# EAGLE design CAN Control (EAGLE 9.5.2)

## Sheet 1 of 2
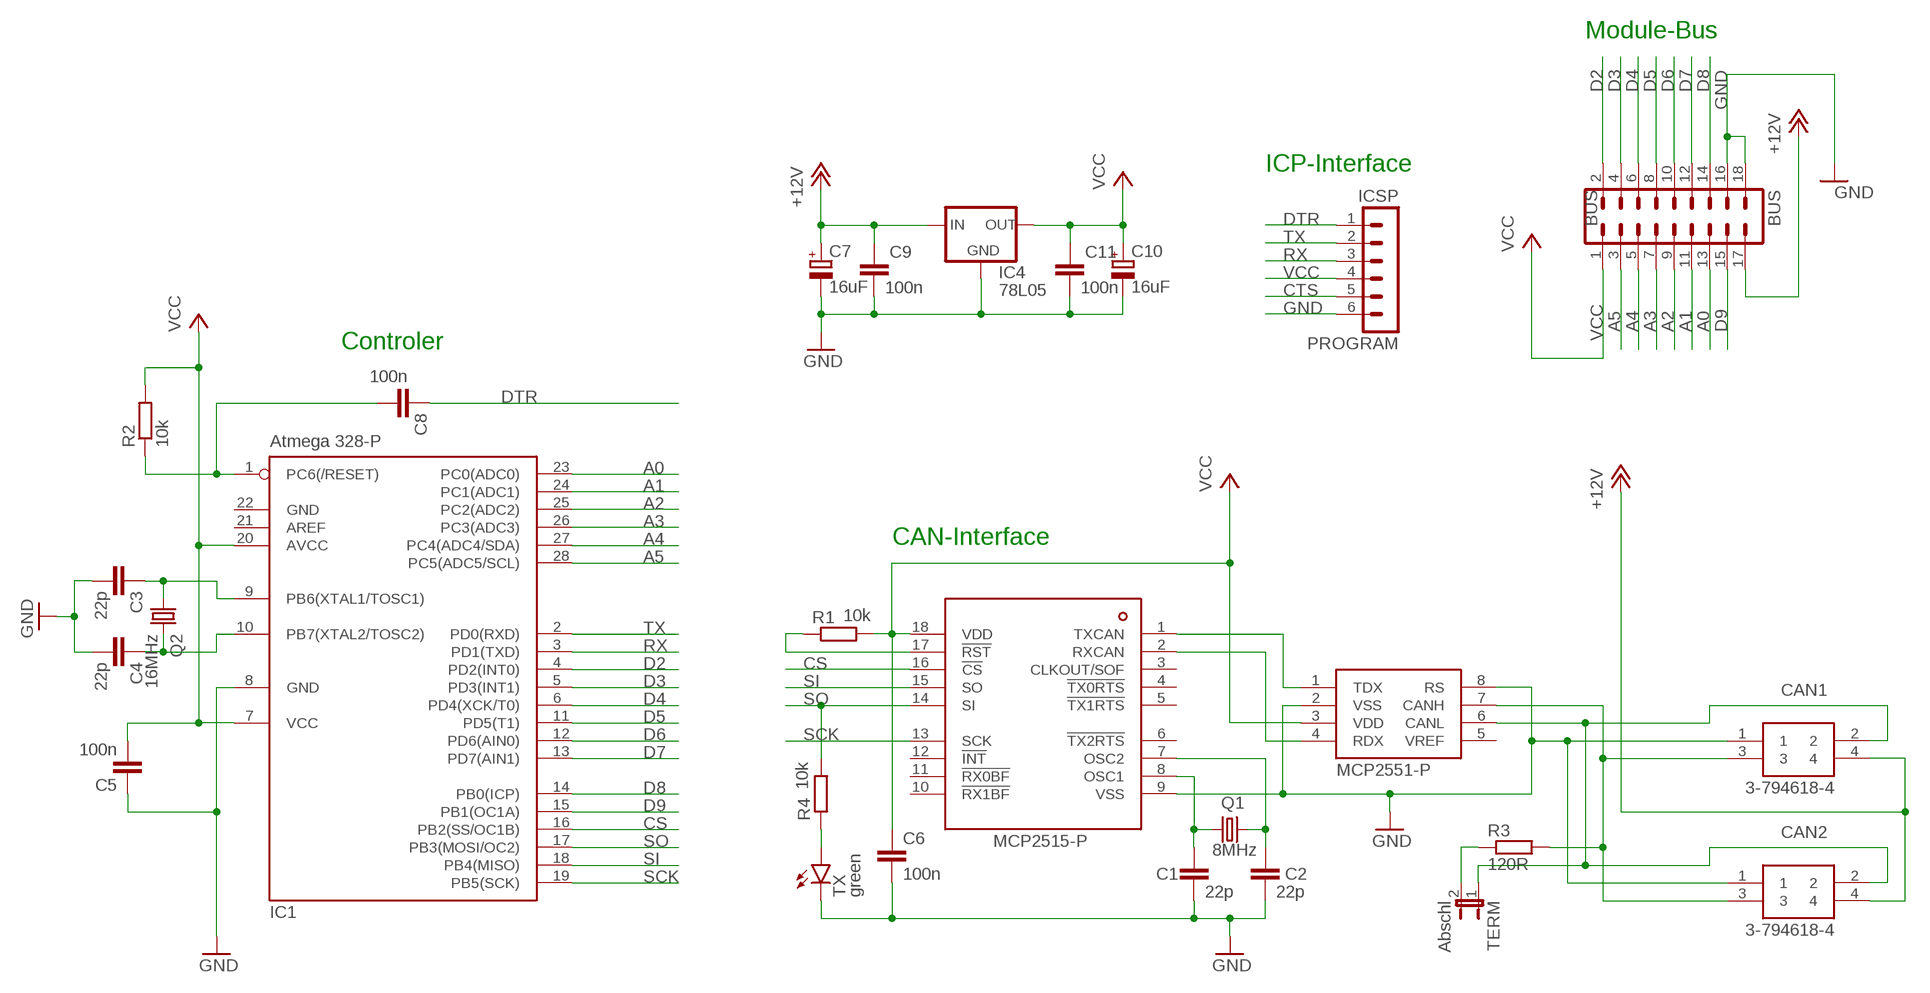
[diagram p0: schematic, sheet 1]

### Parts
BUS  BUS  MA09-2  [MA09-2]
C1  22p  C-EU025-024X044  [C025-024X044]
C2  22p  C-EU025-024X044  [C025-024X044]
C3  22p  C-EU025-024X044  [C025-024X044]
C4  22p  C-EU025-024X044  [C025-024X044]
C5  100n  C-EU025-024X044  [C025-024X044]
C6  100n  C-EU025-024X044  [C025-024X044]
C7  16uF  CPOL-EUE2-5  [E2-5]
C8  100n  C-EU025-024X044  [C025-024X044]
C9  100n  C-EU025-024X044  [C025-024X044]
C10  16uF  CPOL-EUE2-5  [E2-5]
C11  100n  C-EU025-024X044  [C025-024X044]
CAN1  3-794618-4  [SHDRRA4W102P300_2X2_686X892X73]
CAN2  3-794618-4  [SHDRRA4W102P300_2X2_686X892X73]
IC1  Atmega 328-P  MEGA8-P  [DIL28-3]
IC2  MCP2515-P  [DIL18]
IC3  MCP2551-P  [DIL8]
IC4  78L05  78LXX  [78LXX]
PROGRAM  ICSP  MA06-1  [MA06-1]
Q1  8MHz  CRYSTALHC49S  [HC49/S]
Q2  16MHz  CRYSTALHC49S  [HC49/S]
R1  10k  R-EU_0204/2V  [0204V]
R2  10k  R-EU_0204/2V  [0204V]
R3  120R  R-EU_0204/2V  [0204V]
R4  10k  R-EU_0204/2V  [0204V]
TERM  Abschl  JP1E  [JP1]
TX  green  LED3MM  [LED3MM]

### Nets
+12V: BUS.17 C7.+ C9.1 CAN1.4 CAN2.4 IC4.IN
A0: BUS.13 IC1.23(PC0(ADC0))
A1: BUS.11 IC1.24(PC1(ADC1))
A2: BUS.9 IC1.25(PC2(ADC2))
A3: BUS.7 IC1.26(PC3(ADC3))
A4: BUS.5 IC1.27(PC4(ADC4/SDA))
A5: BUS.3 IC1.28(PC5(ADC5/SCL))
CAN2: CAN1.2 CAN2.2 IC3.6(CANL) TERM.1
CAN-H: CAN1.3 CAN2.3 IC3.7(CANH) R3.2
CAN-OCC1: C1.1 IC2.8(OSC1) Q1.1
CAN-OCC2: C2.1 IC2.7(OSC2) Q1.2
CS: IC1.16(PB2(SS/OC1B)) IC2.16(!CS)
CTS: PROGRAM.5
D2: BUS.2 IC1.4(PD2(INT0))
D3: BUS.4 IC1.5(PD3(INT1))
D4: BUS.6 IC1.6(PD4(XCK/T0))
D5: BUS.8 IC1.11(PD5(T1))
D6: BUS.10 IC1.12(PD6(AIN0))
D7: BUS.12 IC1.13(PD7(AIN1))
D8: BUS.14 IC1.14(PB0(ICP))
D9: BUS.15 IC1.15(PB1(OC1A))
DTR: C8.1 PROGRAM.1
GND: BUS.16 BUS.18 C1.2 C2.2 C3.2 C4.2 C5.1 C6.2 C7.- C9.2 C10.- C11.2 CAN1.1 CAN2.1 IC1.8(GND) IC2.9(VSS) IC3.2(VSS) IC3.8(RS) IC4.GND PROGRAM.6 TX.K(C)
N$1: R4.1 TX.A
N$6: IC2.17(!RST) R1.1
N$10: C3.1 IC1.9(PB6(XTAL1/TOSC1)) Q2.1
N$11: C4.1 IC1.10(PB7(XTAL2/TOSC2)) Q2.2
N$14: R3.1 TERM.2
N$15: C8.2 IC1.1(PC6(/RESET)) R2.1
RX: IC1.3(PD1(TXD)) PROGRAM.3
RXCAN: IC2.2(RXCAN) IC3.4(RDX)
SCK: IC1.19(PB5(SCK)) IC2.13(SCK)
SI: IC1.18(PB4(MISO)) IC2.15(SO)
SO: IC1.17(PB3(MOSI/OC2)) IC2.14(SI) R4.2
TX: IC1.2(PD0(RXD)) PROGRAM.2
TXCAN: IC2.1(TXCAN) IC3.1(TDX)
VCC: BUS.1 C5.2 C6.1 C10.+ C11.1 IC1.7(VCC) IC1.20(AVCC) IC2.18(VDD) IC3.3(VDD) IC4.OUT PROGRAM.4 R1.2 R2.2
Unconnected: IC1.21(AREF) IC2.3(CLKOUT/SOF) IC2.4(!TX0RTS) IC2.5(!TX1RTS) IC2.6(!TX2RTS) IC2.10(!RX1BF) IC2.11(!RX0BF) IC2.12(!INT) IC3.5(VREF)

### Notes on the sheet
- Module-Bus
- ICP-Interface
- Controler
- CAN-Interface

## Sheet 2 of 2

## Power pins joined to a net without a drawn wire
GND: IC1.22(GND)

## Library data of the parts
BUS = con-lstb:MA09-2: PIN HEADER; OC_FARNELL: unknown; OC_NEWARK: unknown
C1-C6 C8 C9 C11 = rcl:C-EU: CAPACITOR, European symbol; SPICEPREFIX: C
C7 C10 = rcl:CPOL-EU: POLARIZED CAPACITOR, European symbol; SPICEPREFIX: C
CAN1 CAN2 = SamacSys_Parts:3-794618-4: 4 way 2 row r/a header Mate-N-Lok Source: Datasheet <https://rs.componentsearchengine.com/Datasheets/2/3-794618-4.pdf>; DESCRIPTION: 4 way 2 row r/a header Mate-N-Lok; HEIGHT: 7.37mm; MANUFACTURER_NAME: TE Connectivity; MANUFACTURER_PART_NUMBER: 3-794618-4
IC1 = atmel:MEGA8-P: MICROCONTROLLER 8 Kbytes FLASH, 1 kbytes SRAM, 512 bytes EEPROM, USART, 4-channel 10 bit ADC, 2-channel 8 bit ADC Pin compatible with Atmega48, ATMega88, ATMega168 Source: avr.lbr; OC_FARNELL: unknown; OC_NEWARK: unknown
IC2 = mcp2514:MCP2515-P: Microchip Technology’s MCP2515 is a stand-alone Controller Area Network (CAN) controller that implements the CAN specification, version 2.0B. It is capable of transmitting and receiving both standard and extended data and remote frames. The MCP2515 has two acceptance masks and six acceptance filters that are used to filter out unwanted messages, thereby reducing the host MCUs overhead. The MCP2515 interfaces with microcontrollers (MCUs) via an industry standard Serial Peripheral Interface (SPI).
IC3 = mcp2514:MCP2551-P
IC4 = v-reg:78LXX: VOLTAGE REGULATOR
PROGRAM = con-lstb:MA06-1: PIN HEADER; OC_FARNELL: unknown; OC_NEWARK: unknown
Q1 Q2 = crystal:CRYSTAL: CRYSTAL; OC_FARNELL: 1667008; OC_NEWARK: unknown
R1-R4 = rcl:R-EU_: RESISTOR, European symbol; SPICEPREFIX: R
TERM = jumper:JP1E: JUMPER
TX = led:LED: LED OSRAM: - CHIPLED LG R971, LG N971, LY N971, LG Q971, LY Q971, LO R971, LY R971 LH N974, LH R974 LS Q976, LO Q976, LY Q976 LO Q996 - Hyper CHIPLED LW Q18S LB Q993, LB Q99A, LB R99A - SideLED LS A670, LO A670, LY A670, LG A670, LP A670 LB A673, LV A673, LT A673, LW A673 LH A674 LY A675 LS A676, LA A676, LO A676, LY A676, LW A676 LS A679, LY A679, LG A679 - Hyper Micro SIDELED® LS Y876, LA Y876, LO Y876, LY Y876 LT Y87S - SmartLED LW L88C, LW L88S LB L89C, LB L89S, LG L890 LS L89K, LO L89K, LY L89K LS L896, LA L896, LO L896, LY L896 - TOPLED LS T670, LO T670, LY T670, LG T670, LP T670 LSG T670, LSP T670, LSY T670, LOP T670, LYG T670 LG T671, LOG T671, LSG T671 LB T673, LV T673, LT T673, LW T673 LH T674 LS T676, LA T676, LO T676, LY T676, LB T676, LH T676, LSB T676, LW T676 LB T67C, LV T67C, LT T67C, LS T67K, LO T67K, LY T67K, LW E67C LS E67B, LA E67B, LO E67B, LY E67B, LB E67C, LV E67C, LT E67C LW T67C LS T679, LY T679, LG T679 LS T770, LO T770, LY T770, LG T770, LP T770 LB T773, LV T773, LT T773, LW T773 LH T774 LS E675, LA E675, LY E675, LS T675 LS T776, LA T776, LO T776, LY T776, LB T776 LHGB T686 LT T68C, LB T68C - Hyper Mini TOPLED® LB M676 - Mini TOPLED Santana® LG M470 LS M47K, LO M47K, LY M47K Source: http://www.osram.convergy.de LUXEON: - LUMILED® LXK2-PW12-R00, LXK2-PW12-S00, LXK2-PW14-U00, LXK2-PW14-V00 LXK2-PM12-R00, LXK2-PM12-S00, LXK2-PM14-U00 LXK2-PE12-Q00, LXK2-PE12-R00, LXK2-PE12-S00, LXK2-PE14-T00, LXK2-PE14-U00 LXK2-PB12-K00, LXK2-PB12-L00, LXK2-PB12-M00, LXK2-PB14-N00, LXK2-PB14-P00, LXK2-PB14-Q00 LXK2-PR12-L00, LXK2-PR12-M00, LXK2-PR14-Q00, LXK2-PR14-R00 LXK2-PD12-Q00, LXK2-PD12-R00, LXK2-PD12-S00 LXK2-PH12-R00, LXK2-PH12-S00 LXK2-PL12-P00, LXK2-PL12-Q00, LXK2-PL12-R00 Source: www.luxeon.com KINGBRIGHT: KA-3528ASYC Source: www.kingbright.com

## Board
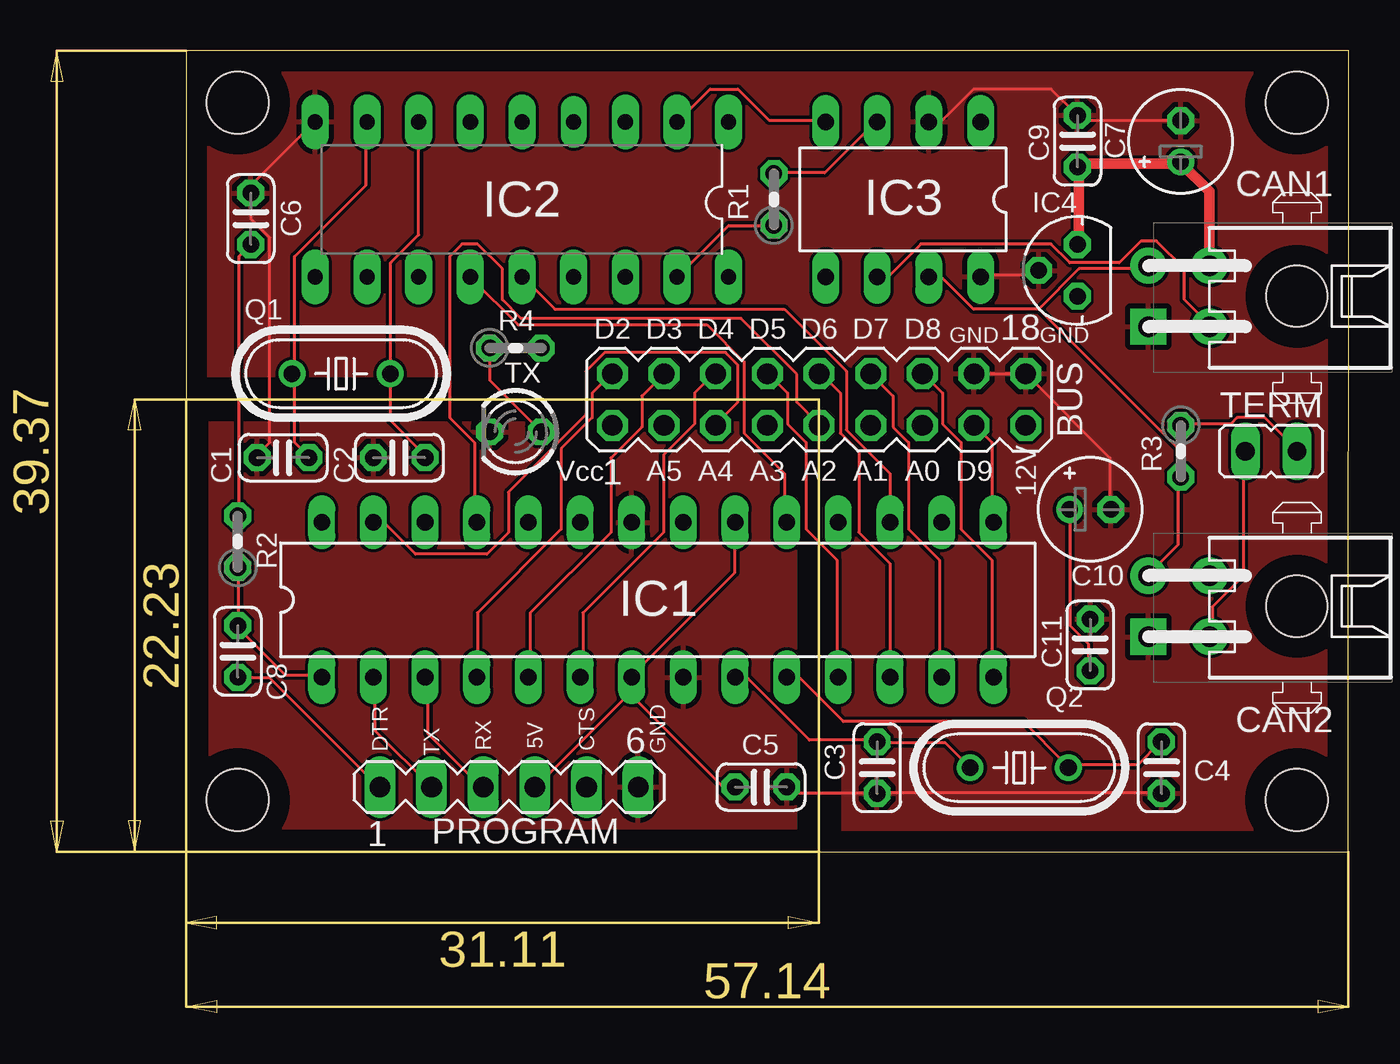
[diagram p1: board, top side]
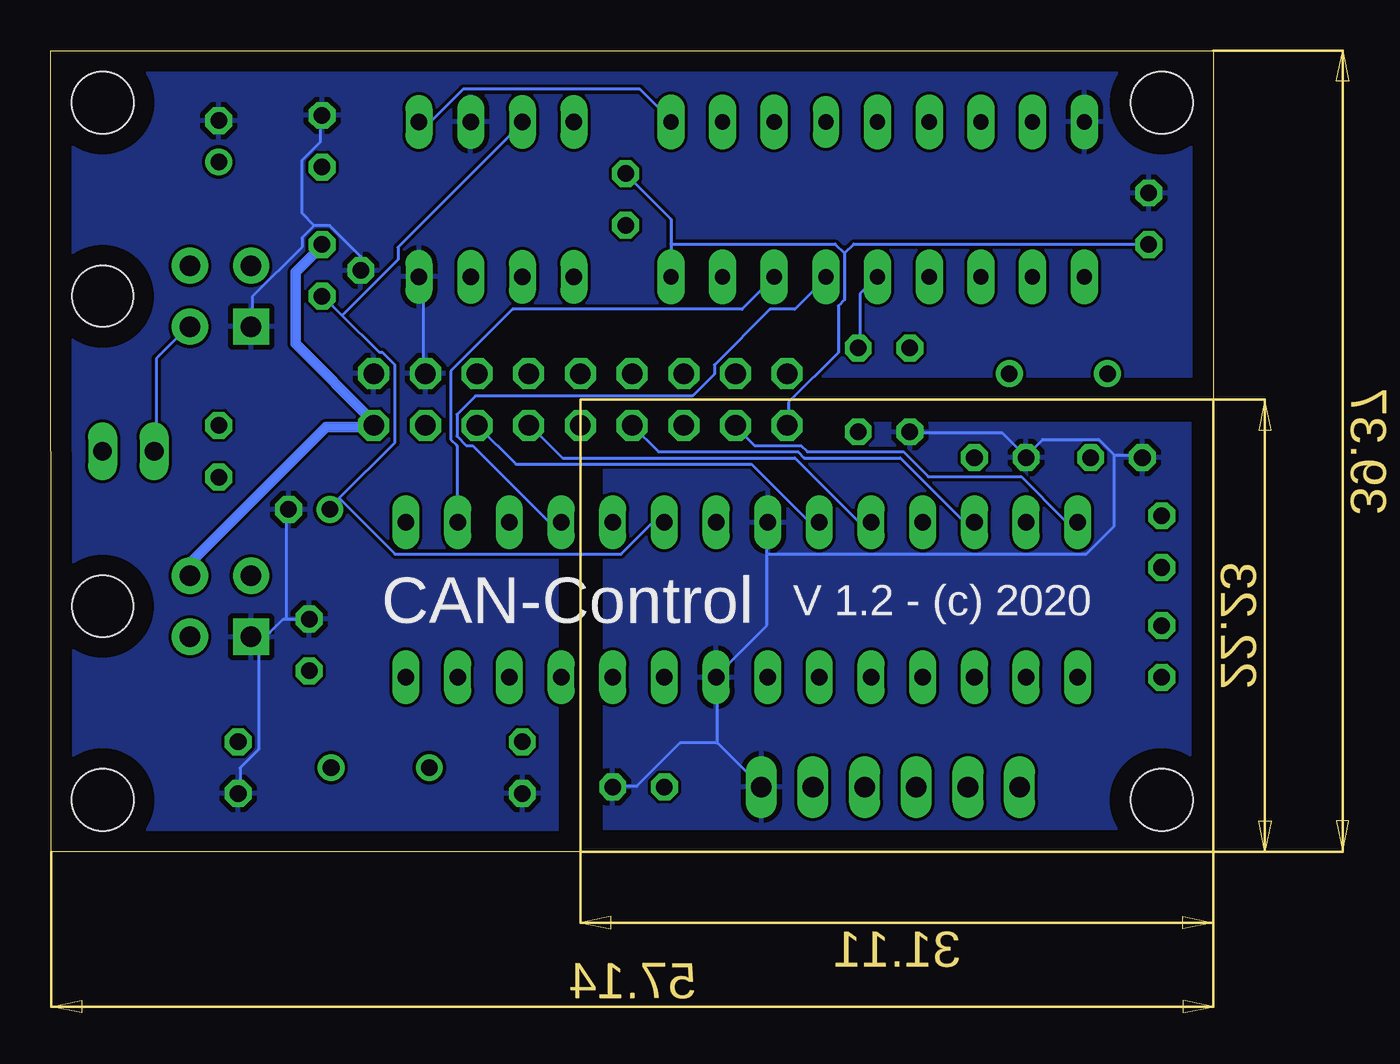
[diagram p2: board, bottom side, seen from below]

Size 57.15 x 39.37 mm. Coordinates in mm from the lower left corner, seen from the top.
Outline: 0,0 57.14,0 57.15,39.37 0,39.37 0,0
Copper layers (1*16): Top 0.035mm / dielectric 1.5mm / Bottom 0.035mm
Design rules "default": minimum track width 6mil, minimum drill 0.35mm, track to track 6mil, track to pad 6mil, pad to pad 6mil, via to via 6mil, smd to smd 6mil, copper to edge 40mil, drill to drill 6mil, minimum pad ring 10mil, minimum via ring 8mil, stop-mask expansion 4mil, vias tented up to drill 0mil, thermal gap 10mil
Holes 3.05 mm at 2.54,36.83 2.54,2.54 54.61,2.54 54.61,36.83

### Footprints (pad centres in the part's own frame; a part is rotated, then mirrored left to right if it is on the bottom)
MA09-2 = drill 1.016 octagon: 1 -10.16,-1.27; 2 -10.16,1.27; 3 -7.62,-1.27; 4 -7.62,1.27; 5 -5.08,-1.27; 6 -5.08,1.27; 7 -2.54,-1.27; 8 -2.54,1.27; 9 0,-1.27; 10 0,1.27; 11 2.54,-1.27; 12 2.54,1.27; 13 5.08,-1.27; 14 5.08,1.27; 15 7.62,-1.27; 16 7.62,1.27; 17 10.16,-1.27; 18 10.16,1.27
C025-024X044 = drill 0.813 octagon: 1 -1.27,0; 2 1.27,0
E2-5 = drill 0.813 pad 1.27: + -1.016,0 | drill 0.813 pad 1.27 octagon: - 1.016,0
SHDRRA4W102P300_2X2_686X892X73 = drill 1 pad 1.778 square: 1 1.5,-7.3 | drill 1 pad 1.778: 2 1.5,-4.3; 3 -1.5,-7.3; 4 -1.5,-4.3 | hole 3: 0,0
DIL28-3 = drill 0.813 long: 1 -16.51,-3.81; 2 -13.97,-3.81; 3 -11.43,-3.81; 4 -8.89,-3.81; 5 -6.35,-3.81; 6 -3.81,-3.81; 7 -1.27,-3.81; 8 1.27,-3.81; 9 3.81,-3.81; 10 6.35,-3.81; 11 8.89,-3.81; 12 11.43,-3.81; 13 13.97,-3.81; 14 16.51,-3.81; 15 16.51,3.81; 16 13.97,3.81; 17 11.43,3.81; 18 8.89,3.81; 19 6.35,3.81; 20 3.81,3.81; 21 1.27,3.81; 22 -1.27,3.81; 23 -3.81,3.81; 24 -6.35,3.81; 25 -8.89,3.81; 26 -11.43,3.81; 27 -13.97,3.81; 28 -16.51,3.81
DIL18 = drill 0.743 pad 1.343 long: 1 -3.81,10.16; 2 -3.81,7.62; 3 -3.81,5.08; 5 -3.81,0; 6 -3.81,-2.54; 7 -3.81,-5.08; 8 -3.81,-7.62; 9 -3.81,-10.16; 10 3.81,-10.16; 11 3.81,-7.62; 12 3.81,-5.08; 13 3.81,-2.54; 14 3.81,0; 15 3.81,2.54; 16 3.81,5.08; 17 3.81,7.62; 18 3.81,10.16 | drill 0.743 pad 1.27 long: 4 -3.81,2.54
DIL8 = drill 0.813 long: 1 -3.81,-3.81; 2 -1.27,-3.81; 3 1.27,-3.81; 4 3.81,-3.81; 5 3.81,3.81; 6 1.27,3.81; 7 -1.27,3.81; 8 -3.81,3.81
78LXX = drill 0.813 octagon: GND 0,1.905; IN 1.27,0; OUT -1.27,0
MA06-1 = drill 1.016 long: 1 -6.35,0; 2 -3.81,0; 3 -1.27,0; 4 1.27,0; 5 3.81,0; 6 6.35,0
HC49/S = drill 0.813: 1 -2.413,0; 2 2.413,0
0204V = drill 0.813 octagon: 1 -1.27,0; 2 1.27,0
JP1 = drill 0.914 long: 1 0,-1.27; 2 0,1.27
LED3MM = drill 0.813 octagon: A -1.27,0; K 1.27,0

### Placement (x,y rotation side)
BUS  31.11,22.23 0 top
C1  4.76,19.37 180 top
C2  10.48,19.37 180 top
C3  33.97,4.13 270 top
C4  47.94,4.13 270 top
C5  28.26,3.17 180 top
C6  3.17,31.11 90 top
C7  48.9,34.92 90 top
C8  2.54,9.84 90 top
C9  43.81,34.92 90 top
C10  44.45,16.83 0 top
C11  44.45,10.16 90 top
CAN1  54.61,27.3 270 top
CAN2  54.61,12.06 270 top
IC1  23.18,12.38 0 top
IC2  16.51,32.07 270 top
IC3  35.24,32.07 180 top
IC4  43.81,28.57 90 top
PROGRAM  15.88,3.17 0 top
Q1  7.62,23.5 0 top
Q2  40.96,4.13 0 top
R1  28.89,32.07 90 top
R2  2.54,15.24 90 top
R3  48.9,19.68 270 top
R4  16.19,24.77 0 top
TERM  53.34,19.68 270 top
TX  16.19,20.64 180 top

### Tracks (layer width: path | path; a pad name or v marks a point on that pad's centre or on a via)
+12V
  Top 0.152: 43.89,33.68 C9.1 | 48.92,33.83 C7.+
  Top 0.508: IC4.IN 43.89,29.87 43.89,33.53 C9.1 | 43.89,33.68 44.04,33.83 48.77,33.83 C7.+ | 48.92,33.83 50.29,32.46 50.29,28.96 CAN1.4
  Bottom 0.152: 41.3,21.03 BUS.17 41.3,20.88 | 43.89,29.72 IC4.IN
  Bottom 0.508: 41.3,21.03 41.3,21.14 45.12,24.97 45.12,28.49 43.89,29.72 | CAN2.4 50.31,14.19 43.62,20.88 41.3,20.88
A0
  Bottom 0.152: BUS.13 34.29,19.05 22.71,19.05 19.96,16.31 19.51,16.31 IC1.23
A1
  Bottom 0.152: IC1.24 16.92,16.31 17.53,16.31 20.57,19.36 32,19.36 33.53,20.88 BUS.11
A2
  Top 0.152: IC1.25 14.17,16.31 14.17,20.12 12.95,21.34 12.95,29.26 13.56,29.87 14.33,29.87 15.54,28.65 15.54,27.13 16.46,26.21 27.28,26.21 30.02,23.47 30.02,22.1 31.09,21.03 BUS.9
A3
  Bottom 0.152: BUS.7 27.28,19.66 20.42,19.66 20.12,19.36 15.39,19.36 12.34,16.31 11.89,16.31 IC1.26
A4
  Top 0.152: IC1.27 9.3,16.15 9.75,16.15 11.28,14.63 14.78,14.63 15.85,15.7 15.85,17.68 19.66,21.49 19.66,23.62 20.57,24.54 26.52,24.54 27.13,23.93 27.13,22.1 26.06,21.03 BUS.5
A5
  Bottom 0.152: IC1.28 6.71,16.31 7.32,16.31 9.45,18.44 14.02,18.44 15.24,19.66 19.96,19.66 20.27,19.96 22.55,19.96 23.47,20.88 BUS.3
CAN2
  Top 0.152: IC3.6 33.98,28.35 34.59,28.35 36.12,29.87 42.52,29.87 43.43,28.96 45.87,28.96 46.94,30.02 47.7,30.02 49.07,28.65 49.07,27.13 50.29,25.91 CAN1.2 | CAN2.2 50.44,10.67 50.44,12.04 51.97,13.56 51.97,19.66 TERM.1
  Bottom 0.152: TERM.1 51.97,19.81 51.97,24.23 50.44,25.76 CAN1.2
CAN-H
  Top 0.152: CAN2.3 47.4,13.72 48.77,15.09 48.77,18.29 R3.2 48.77,18.44 48.77,19.81 41.91,26.67 | 41.91,26.67 38.71,26.67 37.19,28.19 36.58,28.19 IC3.7 | 41.91,26.67 43.89,28.65 47.09,28.65 47.24,28.8 CAN1.3
CAN-OCC1
  Top 0.152: C1.1 5.94,19.51 5.33,20.12 5.33,23.47 Q1.1 5.33,23.62 5.33,29.26 8.84,32.77 8.84,35.81 IC2.8
CAN-OCC2
  Top 0.152: C2.1 11.73,19.51 10.06,21.18 10.06,23.47 Q1.2 10.06,23.62 10.06,28.96 11.43,30.33 IC2.7
CS
  Bottom 0.152: IC1.16 37.19,16.31 37.19,19.96 37.49,20.27 37.49,23.62 34.44,26.67 23.16,26.67 21.64,28.19 IC2.16
D2
  Top 0.152: IC1.4 14.33,8.69 14.33,11.73 18.44,15.85 18.44,19.81 19.96,21.34 19.96,22.55 20.88,23.47 BUS.2
D3
  Top 0.152: BUS.4 22.4,22.4 22.4,20.88 20.88,19.36 20.88,15.7 16.92,11.73 16.92,8.69 IC1.5
D4
  Top 0.152: IC1.6 19.51,8.69 19.51,11.73 23.47,15.7 23.47,19.51 24.99,21.03 24.99,22.55 25.91,23.47 BUS.6
D5
  Top 0.152: IC1.11 32,8.69 32,14.33 30.48,15.85 30.48,20.12 29.57,21.03 29.57,22.55 28.65,23.47 BUS.8
D6
  Top 0.152: IC1.12 34.59,8.69 34.59,14.17 33.07,15.7 33.07,19.66 32.16,20.57 32.16,22.55 31.24,23.47 BUS.10
D7
  Top 0.152: BUS.12 34.75,22.4 34.75,20.88 35.51,20.12 35.51,15.85 37.03,14.33 37.03,8.69 IC1.13
D8
  Top 0.152: IC1.14 39.62,8.69 39.62,14.33 38.1,15.85 38.1,20.12 37.19,21.03 37.19,22.55 36.27,23.47 BUS.14
D9
  Top 0.152: IC1.15 39.62,16.31 39.62,20.12 38.86,20.88 BUS.15
DTR
  Top 0.152: C8.1 2.59,8.53 4.12,8.53 9.45,3.2 PROGRAM.1
GND
  Top 0.152: IC2.9 6.25,35.81 3.2,32.77 3.2,32.46 C6.2 3.2,32.31 3.2,31.09 4.12,30.18 4.12,20.12 3.5,19.51 C1.2 | C5.1 29.57,3.05 29.72,2.9 33.83,2.9 C3.2 33.98,2.9 47.85,2.9 C4.2 | IC3.2 36.58,35.97 37.19,35.97 38.71,37.49 42.52,37.49 C9.2 44.04,35.97 48.77,35.97 C7.- | BUS.16 38.86,23.47 41.15,23.47 BUS.18 45.41,19.36 45.41,16.92 C10.- | IC3.8 39.17,28.35 41.76,28.35 41.91,28.5 IC4.GND
  Bottom 0.152: 4.88,19.51 3.5,19.51 C1.2 | 4.88,19.51 5.64,20.27 8.38,20.27 9.14,19.51 C2.2 9.3,19.51 10.36,20.57 14.78,20.57 TX.K | 24.38,5.33 24.38,8.53 IC1.8 24.38,8.69 21.95,11.12 21.95,14.63 | PROGRAM.6 24.38,5.33 | 21.95,14.63 21.95,16.15 IC1.22 | 24.38,5.33 26.21,5.33 28.35,3.2 29.41,3.2 C5.1 | 46.94,10.21 46.94,5.03 47.85,4.12 47.85,2.9 C4.2 | 46.94,10.21 47.24,10.52 CAN2.1 46.94,10.21 | 45.57,11.43 45.72,11.43 46.94,10.21 | 45.57,11.43 C11.2 | 45.57,11.43 45.57,16.76 C10.- | 44.2,30.79 44.81,30.18 44.81,29.72 47.24,27.28 47.24,25.91 CAN1.1 | 44.2,30.79 43.43,30.79 41.91,29.26 IC4.GND | BUS.16 38.86,23.62 38.86,28.04 39.01,28.19 IC3.8 | 44.2,30.79 44.81,31.39 44.81,33.98 43.89,34.9 43.89,36.12 C9.2 | 4.88,19.51 4.88,16 6.25,14.63 21.95,14.63
  pour Bottom: 0,39.37 57.15,39.37 57.15,0 0,0
  pour Top: 0,39.37 57.15,39.37 57.15,0 0,0
N$1
  Top 0.152: TX.A 14.94,23.16 14.94,24.69 R4.1
N$6
  Top 0.152: R1.1 28.8,30.79 26.67,30.79 24.23,28.35 IC2.17
N$10
  Top 0.152: Q2.1 37.34,5.33 33.98,5.33 C3.1 33.83,5.49 30.63,5.49 27.58,8.53 27.13,8.53 IC1.9
N$11
  Top 0.152: C4.1 47.85,5.33 46.79,4.27 43.43,4.27 Q2.2 43.28,4.27 41.15,6.4 32.31,6.4 30.18,8.53 29.57,8.53 IC1.10
N$14
  Top 0.152: R3.1 48.92,21.03 51.36,21.03 51.66,21.34 53.03,21.34 54.56,19.81 TERM.2
N$15
  Top 0.152: IC1.1 6.55,8.69 4.88,8.69 2.59,10.97 C8.2 2.59,11.12 2.59,13.87 R2.1
RX
  Top 0.152: IC1.3 11.89,8.53 11.89,5.79 14.48,3.2 PROGRAM.3
RXCAN
  Top 0.152: IC3.4 31.39,35.97 28.65,35.97 27.13,37.49 25.76,37.49 24.23,35.97 IC2.2
SCK
  Top 0.152: IC1.19 29.41,16.31 29.41,18.59 27.43,20.57 27.43,24.08 25.6,25.91 16.31,25.91 14.02,28.19 IC2.13
SI
  Bottom 0.152: IC1.18 32.16,16.31 32.77,16.31 36.42,19.96 36.73,19.96 37.19,20.42 37.19,21.49 36.27,22.4 25.6,22.4 24.54,23.47 24.54,23.93 21.79,26.67 20.57,26.67 19.05,28.19 IC2.15
SO
  Top 0.152: IC1.17 34.59,16.31 34.59,18.59 32.46,20.73 32.46,23.62 29.41,26.67 18.14,26.67 16.61,28.19 IC2.14
  Bottom 0.152: R4.2 17.37,24.84 17.37,27.43 16.61,28.19 IC2.14
TX
  Top 0.152: PROGRAM.2 9.3,5.94 9.3,8.53 IC1.2
TXCAN
  Bottom 0.152: IC3.1 39.01,35.97 38.41,35.97 36.88,37.49 28.19,37.49 26.67,35.97 IC2.1
VCC
  Top 0.152: 21.79,7.77 21.79,8.53 IC1.7 | 21.79,7.77 17.22,3.2 PROGRAM.4 | 21.79,7.77 26.36,3.2 26.98,3.2 C5.2 | 21.79,7.77 IC1.7 | IC1.20 26.98,16.15 26.98,13.72 21.95,8.69 IC1.7 | C10.+ 43.43,11.12 44.35,10.21 44.35,8.99 C11.1 | C6.1 2.59,29.26 2.59,16.61 R2.2 | R1.2 28.96,33.38 31.39,33.38 33.83,35.81 IC3.3
  Bottom 0.152: 42.82,26.36 41,24.54 40.84,24.54 40.23,23.93 40.23,20.12 42.98,17.37 | 42.82,26.36 43.74,27.28 IC4.OUT | 42.98,17.37 43.43,16.92 C10.+ | 26.67,29.87 26.67,31.09 28.8,33.22 R1.2 | 26.67,29.87 IC2.18 | 18.14,29.41 18.14,27.13 18.44,26.82 18.44,24.54 20.88,22.1 20.88,21.03 BUS.1 | 18.14,29.41 18.59,29.87 26.67,29.87 | 18.14,29.41 17.68,29.87 3.2,29.87 C6.1 | 42.82,26.36 40.08,29.11 40.08,29.72 33.98,35.81 IC3.3 | 42.98,17.37 40.23,14.63 29.11,14.63 27.58,16.15 27.13,16.15 IC1.20

### Text on the board
tNames: D2 | D3 | D4 | D5 | D6 | D7 | D8 | GND | GND | Vcc | A5 | A4 | A3 | A2 | A1 | A0 | D9 | 12V | DTR | RX | 5V | CTS | GND | TX
bNames: V 1.2 - (c) 2020 | CAN-Control